# Altium schematic sheet mcu.SchDoc
size A3; SheetNumber: 1; SheetTotal: 2
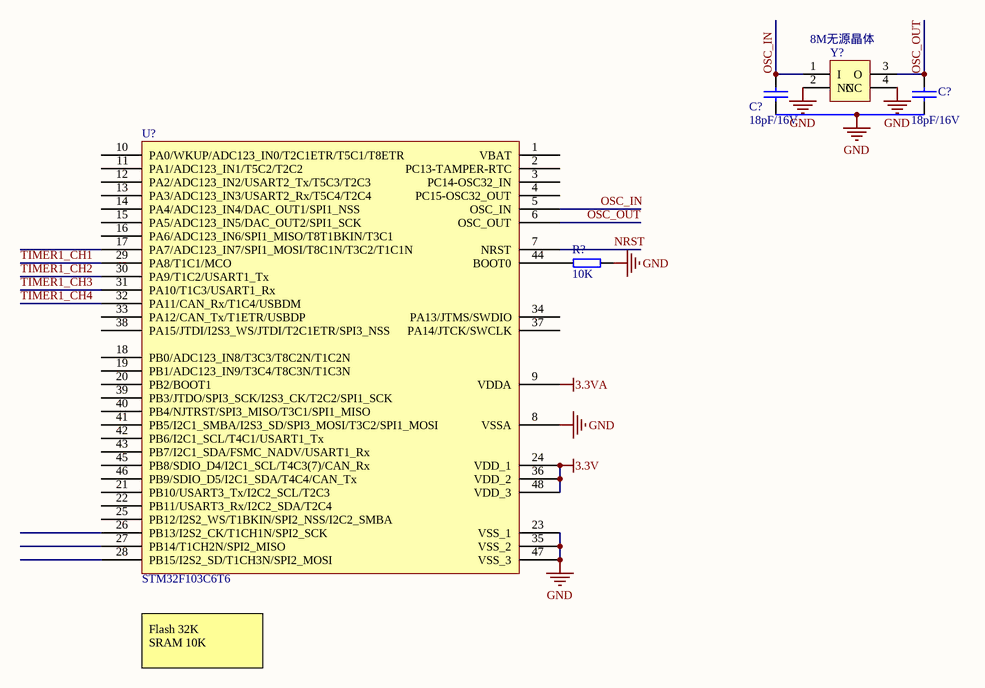
[diagram p0: mcu.SchDoc]

## Parts
(Parts that share a designator on the sheet are numbered #1, #2 ... from top to bottom, then left to right.)
C?#1  18pF/16V  [C0402]
C?#2  18pF/16V  [C0402]
R?  10K  [R0603]
U?  STM32F103C6T6  [LQFP-48_M]
Y?  8M无源晶体  [5032 4pin]

## Nets
3.3V: U?.24(VDD_1) U?.36(VDD_2) U?.48(VDD_3)
3.3VA: U?.9(VDDA)
GND: C?#1.1 C?#2.1 R?.1 U?.8(VSSA) U?.23(VSS_1) U?.35(VSS_2) U?.47(VSS_3) Y?.2(NC) Y?.4(NC)
NRST: U?.7(NRST)
OSC_IN: C?#1.2 U?.5(OSC_IN) Y?.1(I)
OSC_OUT: C?#2.2 U?.6(OSC_OUT) Y?.3(O)
TIMER1_CH1: U?.29(PA8/T1C1/MCO)
TIMER1_CH2: U?.30(PA9/T1C2/USART1_Tx)
TIMER1_CH3: U?.31(PA10/T1C3/USART1_Rx)
TIMER1_CH4: U?.32(PA11/CAN_Rx/T1C4/USBDM)
NetR?_2: R?.2 U?.44(BOOT0)

Not connected (* = marked no-connect by the designer): U? 1(VBAT) 2(PC13-TAMPER-RTC) 3(PC14-OSC32_IN) 4(PC15-OSC32_OUT) 10(PA0/WKUP/ADC123_IN0/T2C1ETR/T5C1/T8ETR) 11(PA1/ADC123_IN1/T5C2/T2C2) 12(PA2/ADC123_IN2/USART2_Tx/T5C3/T2C3) 13(PA3/ADC123_IN3/USART2_Rx/T5C4/T2C4) 14(PA4/ADC123_IN4/DAC_OUT1/SPI1_NSS) 15(PA5/ADC123_IN5/DAC_OUT2/SPI1_SCK) 16(PA6/ADC123_IN6/SPI1_MISO/T8T1BKIN/T3C1) 17(PA7/ADC123_IN7/SPI1_MOSI/T8C1N/T3C2/T1C1N) 18(PB0/ADC123_IN8/T3C3/T8C2N/T1C2N) 19(PB1/ADC123_IN9/T3C4/T8C3N/T1C3N) 20(PB2/BOOT1) 21(PB10/USART3_Tx/I2C2_SCL/T2C3) 22(PB11/USART3_Rx/I2C2_SDA/T2C4) 25(PB12/I2S2_WS/T1BKIN/SPI2_NSS/I2C2_SMBA) 26(PB13/I2S2_CK/T1CH1N/SPI2_SCK) 27(PB14/T1CH2N/SPI2_MISO) 28(PB15/I2S2_SD/T1CH3N/SPI2_MOSI) 33(PA12/CAN_Tx/T1ETR/USBDP) 34(PA13/JTMS/SWDIO) 37(PA14/JTCK/SWCLK) 38(PA15/JTDI/I2S3_WS/JTDI/T2C1ETR/SPI3_NSS) 39(PB3/JTDO/SPI3_SCK/I2S3_CK/T2C2/SPI1_SCK) 40(PB4/NJTRST/SPI3_MISO/T3C1/SPI1_MISO) 41(PB5/I2C1_SMBA/I2S3_SD/SPI3_MOSI/T3C2/SPI1_MOSI) 42(PB6/I2C1_SCL/T4C1/USART1_Tx) 43(PB7/I2C1_SDA/FSMC_NADV/USART1_Rx) 45(PB8/SDIO_D4/I2C1_SCL/T4C3(7)/CAN_Rx) 46(PB9/SDIO_D5/I2C1_SDA/T4C4/CAN_Tx)

## Notes on the sheet
- Flash 32K
  SRAM 10K

## Library data of the parts
C?#1 C?#2 = CAP: Capacitor
R? = Resistance
U? = STM32F103C: STM32单片机48引脚
Y? = OSC24